# Altium schematic sheet кроссовая буй.SchDoc
size A3; Organization: Yandex; Address2: 11 Timura Frunze st., building 2; Release_Date: yyyy-mm-dd; Language: en; Organization2: Self Driving Group LLC
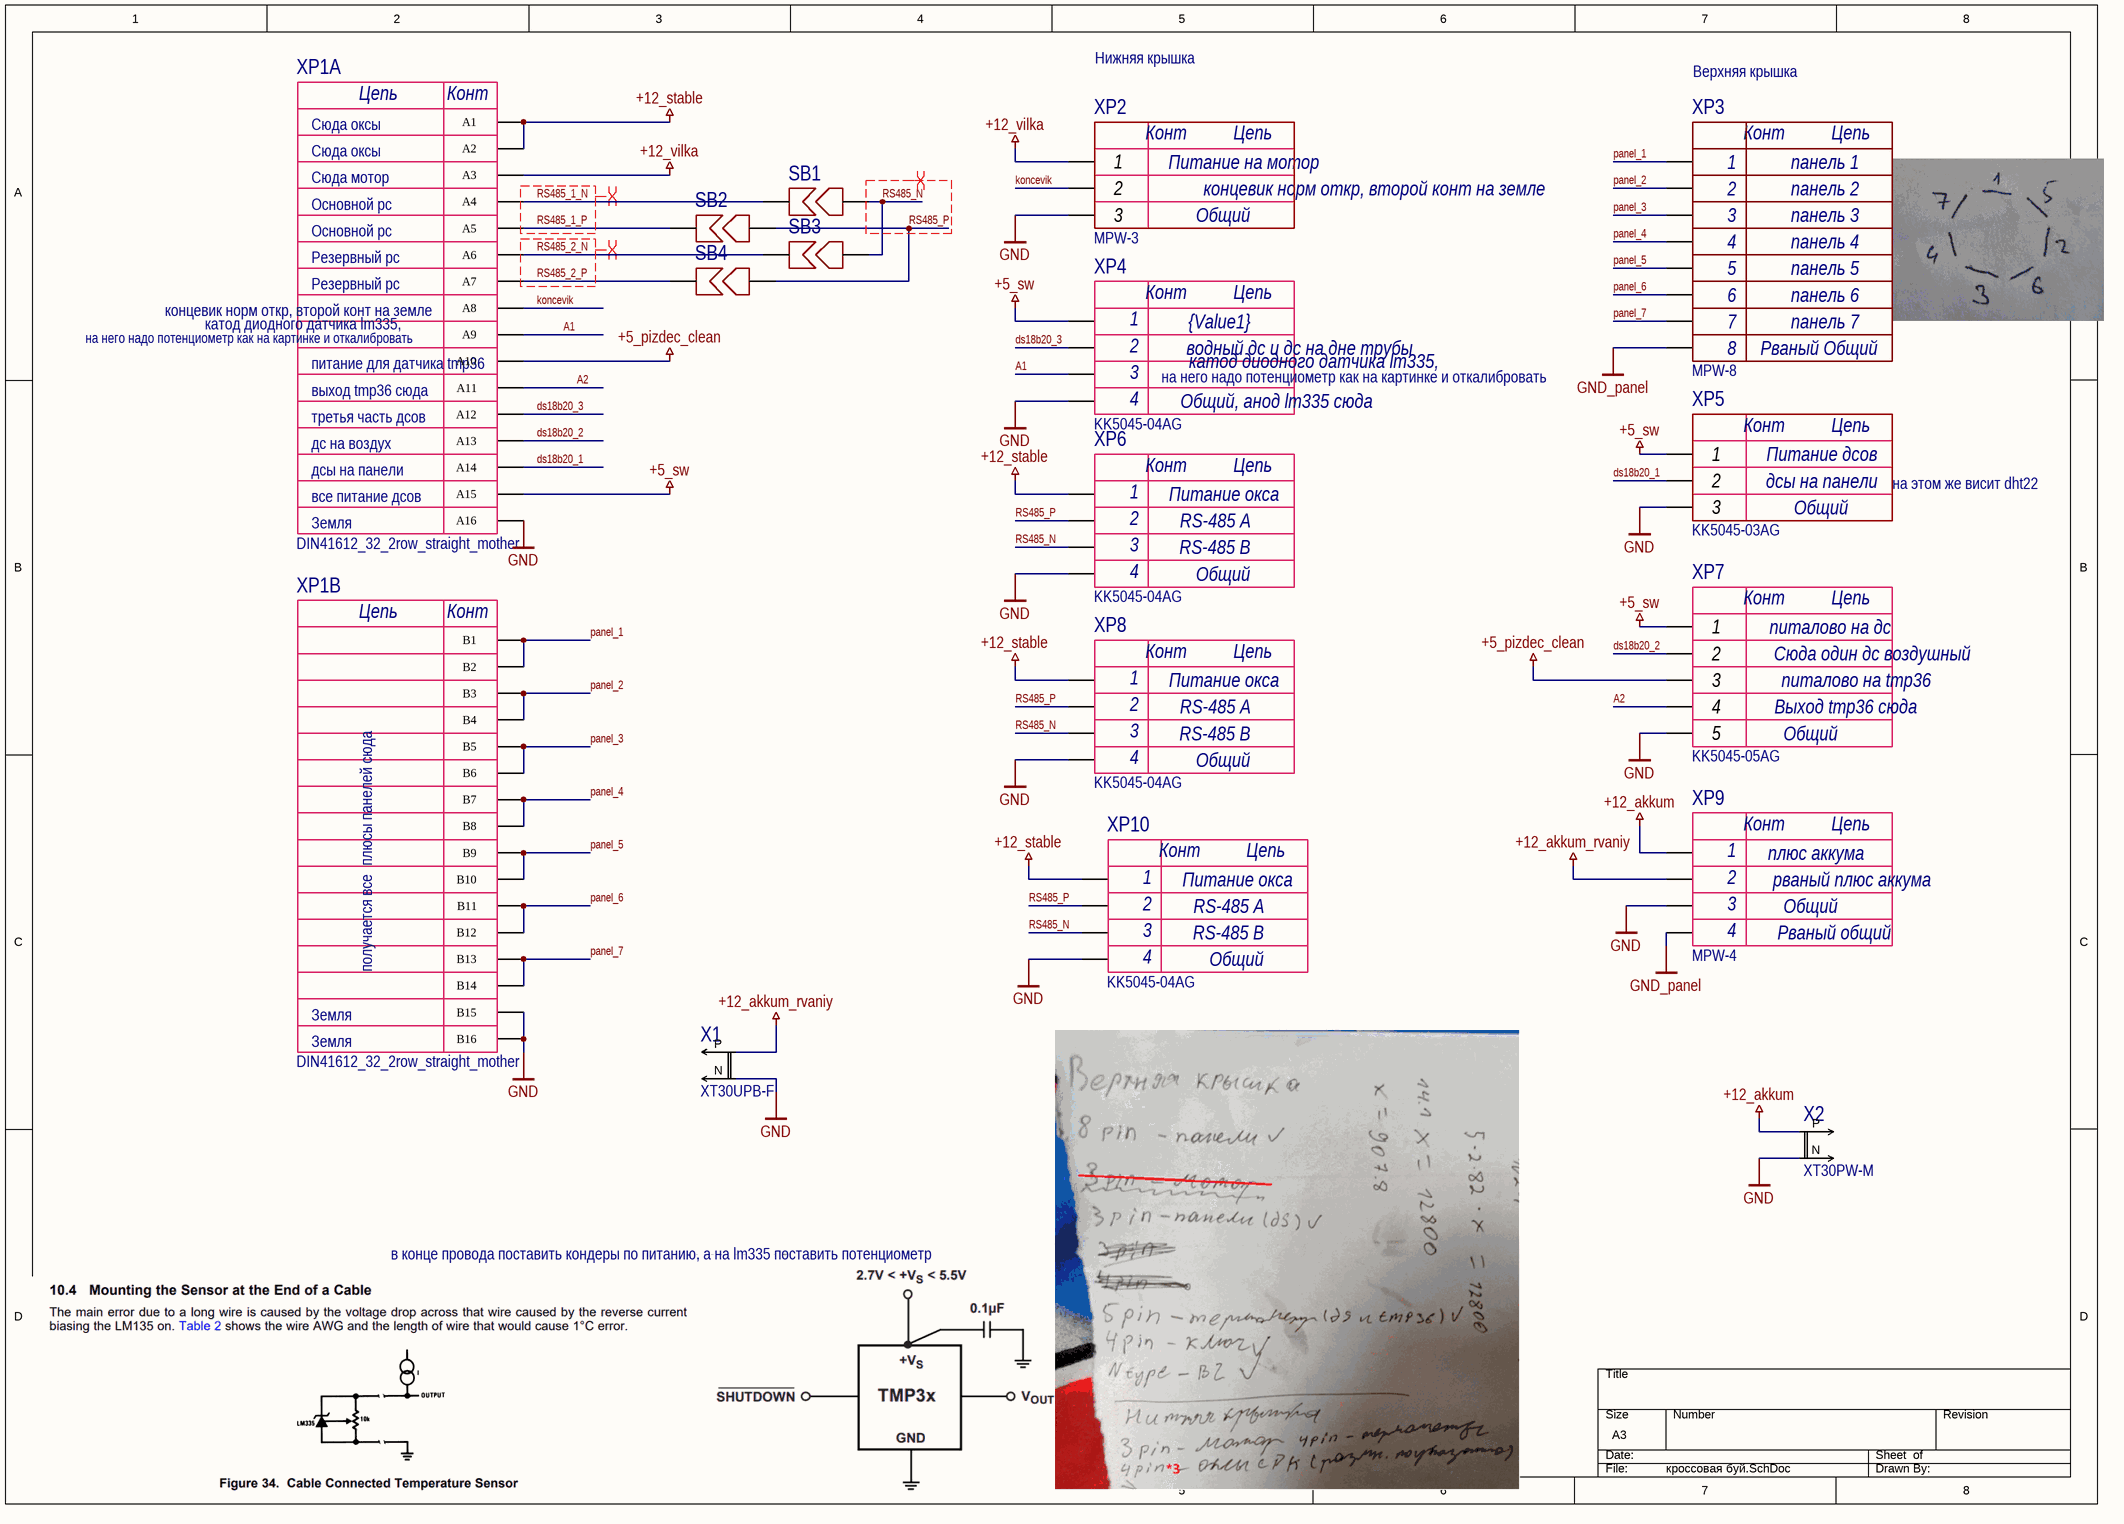
[diagram p0: кроссовая буй.SchDoc]

## Parts
SB1  SB  [0805SB]  (value not drawn)
SB2  SB  [0805SB]  (value not drawn)
SB3  SB  [0805SB]  (value not drawn)
SB4  SB  [0805SB]  (value not drawn)
X1  XT30UPB-F  [XT30UPB-F]
X2  XT30PW-M  [XT30PW-M]
XP1  DIN41612_32_2row_straight_mother  [DIN41612_32_2row_straight_mother]  (parts A,B of 2)
XP2  MPW-3  Value3: Общий  Value2: концевик норм откр, второй конт на земле  Value1: Питание на мотор  [MPW-3]
XP3  MPW-8  Value1: панель 1  Value2: панель 2  Value3: панель 3  Value4: панель 4  Value5: панель 5  Value6: панель 6  Value7: панель 7  Value8: Рваный Общий  [MPW-8]
XP4  KK5045-04AG  Value3: катод диодного датчика lm335,  Value2: водный дс и дс на дне трубы  Value4: Общий, анод lm335 сюда  питалово на дс: {Value1}  [KK5045-04AG]
XP5  KK5045-03AG  Value3: Общий  Value2: дсы на панели  Value1: Питание дсов  [KK5045-03AG]
XP6  KK5045-04AG  Value3: RS-485 B  Value2: RS-485 A  Value4: Общий  Value1: Питание окса  [KK5045-04AG]
XP7  KK5045-05AG  Value1: питалово на дс  Value2: Сюда один дс воздушный  Value3: питалово на tmp36  Value4: Выход tmp36 сюда  Value5: Общий  [KK5045-05AG]
XP8  KK5045-04AG  Value3: RS-485 B  Value2: RS-485 A  Value4: Общий  Value1: Питание окса  [KK5045-04AG]
XP9  MPW-4  Value3: Общий  Value2: рваный плюс аккума  Value4: Рваный общий  Value1: плюс аккума  [MPW-4]
XP10  KK5045-04AG  Value3: RS-485 B  Value2: RS-485 A  Value4: Общий  Value1: Питание окса  [KK5045-04AG]

## Nets
+5_pizdec_clean: XP1.A10 XP7.3
+5_sw: XP1.A15 XP4.1 XP5.1 XP7.1
+12_akkum: X2.P XP9.1
+12_akkum_rvaniy: X1.P XP9.2
+12_stable: XP1.A1 XP1.A2 XP6.1 XP8.1 XP10.1
+12_vilka: XP1.A3 XP2.1
GND: X1.N X2.N XP1.A16 XP1.B15 XP1.B16 XP2.3 XP4.4 XP5.3 XP6.4 XP7.5 XP8.4 XP9.3 XP10.4
GND_panel: XP3.8 XP9.4
A1: XP1.A9 XP4.3
A2: XP1.A11 XP7.4
ds18b20_1: XP1.A14 XP5.2
ds18b20_2: XP1.A13 XP7.2
ds18b20_3: XP1.A12 XP4.2
koncevik: XP1.A8 XP2.2
panel_1: XP1.B1 XP1.B2 XP3.1
panel_2: XP1.B3 XP1.B4 XP3.2
panel_3: XP1.B5 XP1.B6 XP3.3
panel_4: XP1.B7 XP1.B8 XP3.4
panel_5: XP1.B9 XP1.B10 XP3.5
panel_6: XP1.B11 XP1.B12 XP3.6
panel_7: XP1.B13 XP1.B14 XP3.7
RS485_1_N: SB1.1 XP1.A4
RS485_1_P: SB2.1 XP1.A5
RS485_2_N: SB3.1 XP1.A6
RS485_2_P: SB4.1 XP1.A7
RS485_N: SB1.2 SB3.2 XP6.3 XP8.3 XP10.3
RS485_P: SB2.2 SB4.2 XP6.2 XP8.2 XP10.2

## Layout directives
differential pair: RS485_1_N, RS485_1_P, RS485_2_N, RS485_2_P, RS485_N, RS485_P

## Notes on the sheet
- Нижняя крышка
- Верхняя крышка
- Сюда оксы
- Основной рс
- Сюда мотор
- (near XP1) концевик норм откр, второй конт на земле
- Резервный рс
- (near XP1) на него надо потенциометр как на картинке и откалибровать
- (near XP1) катод диодного датчика lm335,
- (near XP1) питание для датчика tmp36
- на него надо потенциометр как на картинке и откалибровать
- (near XP1) выход tmp36 сюда
- дс на воздух
- (near XP1) третья часть дсов
- (near XP1) все питание дсов
- дсы на панели
- на этом же висит dht22
- Земля
- плюсы панелей сюда
- получается все
- в конце провода поставить кондеры по питанию, а на lm335 поставить потенциометр
- 1
- 2
- 3
- 4
- 5
- 6
- 7
- 8
- A
- B
- C
- D
- E
- Responsible department
- Technical reference
- Document type
- Document status
- F
- Legal owner
- Created by
- Schematic drawing
- Title, Supplementary title
- CONFIDENTIAL
- Yandex
- Commercial secret
- Self Driving Group LLC
- Approved by
- Doc Rev.
- Date of Issue
- Lang.
- Sheet
- A3
- (in symbol DIN41612_32_2row_straight_mother, part A) Цепь; Конт
- (in symbol DIN41612_32_2row_straight_mother, part B) Цепь; Конт
- (in symbol KK5045-03AG) Конт; Цепь
- (in symbol KK5045-04AG) Конт; Цепь
- (in symbol KK5045-05AG) Конт; Цепь
- (in symbol MPW-3) Конт; Цепь
- (in symbol MPW-4) Конт; Цепь
- (in symbol MPW-8) Конт; Цепь

## Library data of the parts
SB1-SB4 = SB: Solder bridge, мост припоя, запаиваемая перемычка, net tie, jumper; Part Number: SB
X1 = XT30UPB-F: 30 А (15 продолжительно), прямая мать; Part Number: XT30UPB-F
X2 = XT30PW-M: 30 А (15 продолжительно), 2 контакта разъем угловой отец; Part Number: XT30PW-M
XP1 = DIN41612_32_2row_straight_mother: DIN41612 (DS1118-32F0V23), Разъем (розетка) тип B 32pin (2х16), шаг 2.54мм двухрядный прямой (ряд АB); Part Number: DIN41612_32_2row_straight_mother
XP2 = MPW-3: MPW-3 , Вилка на плату 5.08мм прямая 3pin; Part Number: MPW-3
XP3 = MPW-8: MPW-8 , Вилка на плату 5.08мм прямая 8pin; Part Number: MPW-8
XP4 XP6 XP8 XP10 = KK5045-04AG: Разъем типа провод-плата, 2.5 мм, 4 контакта; Part Number: KK5045-04AG
XP5 = KK5045-03AG: Разъем типа провод-плата, 2.5 мм, 3 контакта; Part Number: KK5045-03AG
XP7 = KK5045-05AG: Разъем типа провод-плата, 2.5 мм, 5 контакта; Part Number: KK5045-05AG
XP9 = MPW-4: MPW-4 , Вилка на плату 5.08мм прямая 4pin; Part Number: MPW-4